# Altium schematic sheet Keyboard.SchDoc
size A4
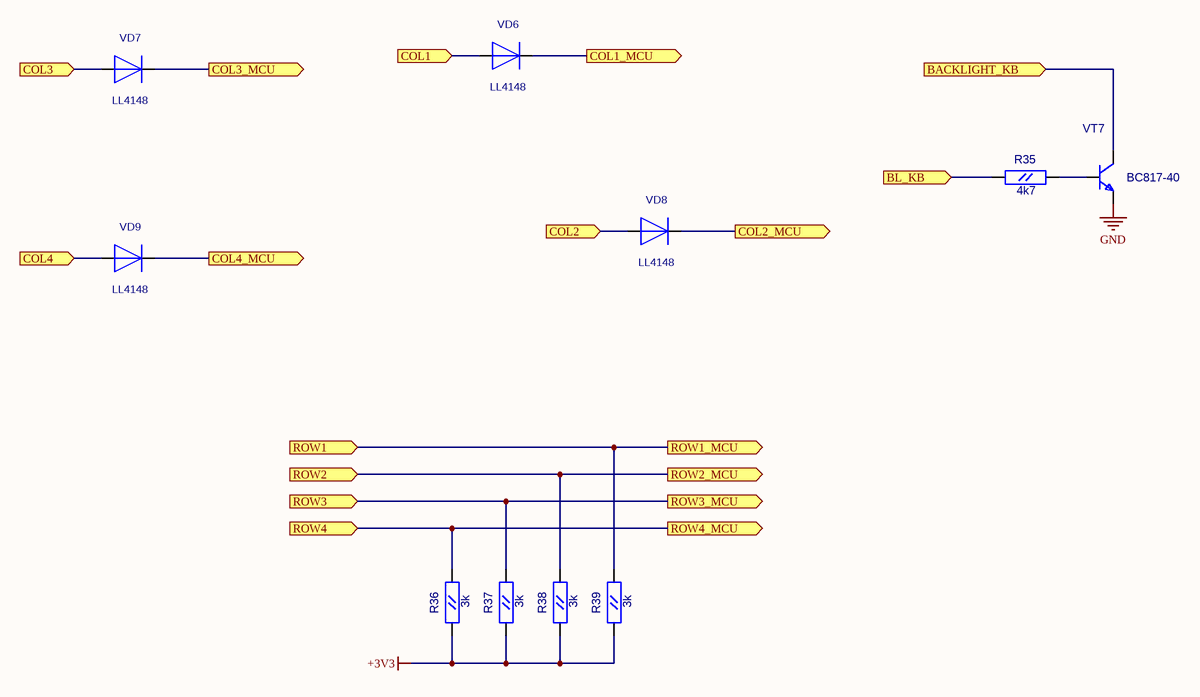
[diagram p0: Keyboard.SchDoc]

## Parts
R35  4k7  [RC0603]
R36  3k  [RC0603]
R37  3k  [RC0603]
R38  3k  [RC0603]
R39  3k  [RC0603]
VD6  LL4148  [SOD-80]
VD7  LL4148  [SOD-80]
VD8  LL4148  [SOD-80]
VD9  LL4148  [SOD-80]
VT7  BC817-40  [SOT-23(123)]

## Ports
BACKLIGHT_KB (in), BL_KB (in), COL1 (in), COL1_MCU (out), COL2 (in), COL2_MCU (out), COL3 (in), COL3_MCU (out), COL4 (in), COL4_MCU (out), ROW1 (in), ROW1_MCU (out), ROW2 (in), ROW2_MCU (out), ROW3 (in), ROW3_MCU (out), ROW4 (in), ROW4_MCU (out)

## Nets
+3V3: R36.1(A) R37.1(A) R38.1(A) R39.1(A)
GND: VT7.2(E)
BACKLIGHT_KB: VT7.3(C) ; port BACKLIGHT_KB
BL_KB: R35.1(A) ; port BL_KB
COL1: VD6.1(-) ; port COL1
COL1_MCU: VD6.2(+) ; port COL1_MCU
COL2: VD8.1(-) ; port COL2
COL2_MCU: VD8.2(+) ; port COL2_MCU
COL3: VD7.1(-) ; port COL3
COL3_MCU: VD7.2(+) ; port COL3_MCU
COL4: VD9.1(-) ; port COL4
COL4_MCU: VD9.2(+) ; port COL4_MCU
ROW1: R39.2(B) ; port ROW1_MCU, port ROW1
ROW2: R38.2(B) ; port ROW2_MCU, port ROW2
ROW3: R37.2(B) ; port ROW3_MCU, port ROW3
ROW4: R36.2(B) ; port ROW4_MCU, port ROW4
NetR35_2: R35.2(B) VT7.1(B)

## Library data of the parts
R35-R39 = RC0603
  R35: Value: 4k7
  R36-R39: Value: 3k
VT7 = BC846BLT1: NPN 500ma transistor; ComponentField7: Published 29-Sep-2000; OriginalName: BC846BLT1; Value: BC817-40
VD6-VD9 = LL4148: Value: *